# Altium project multimeter.prjpcb
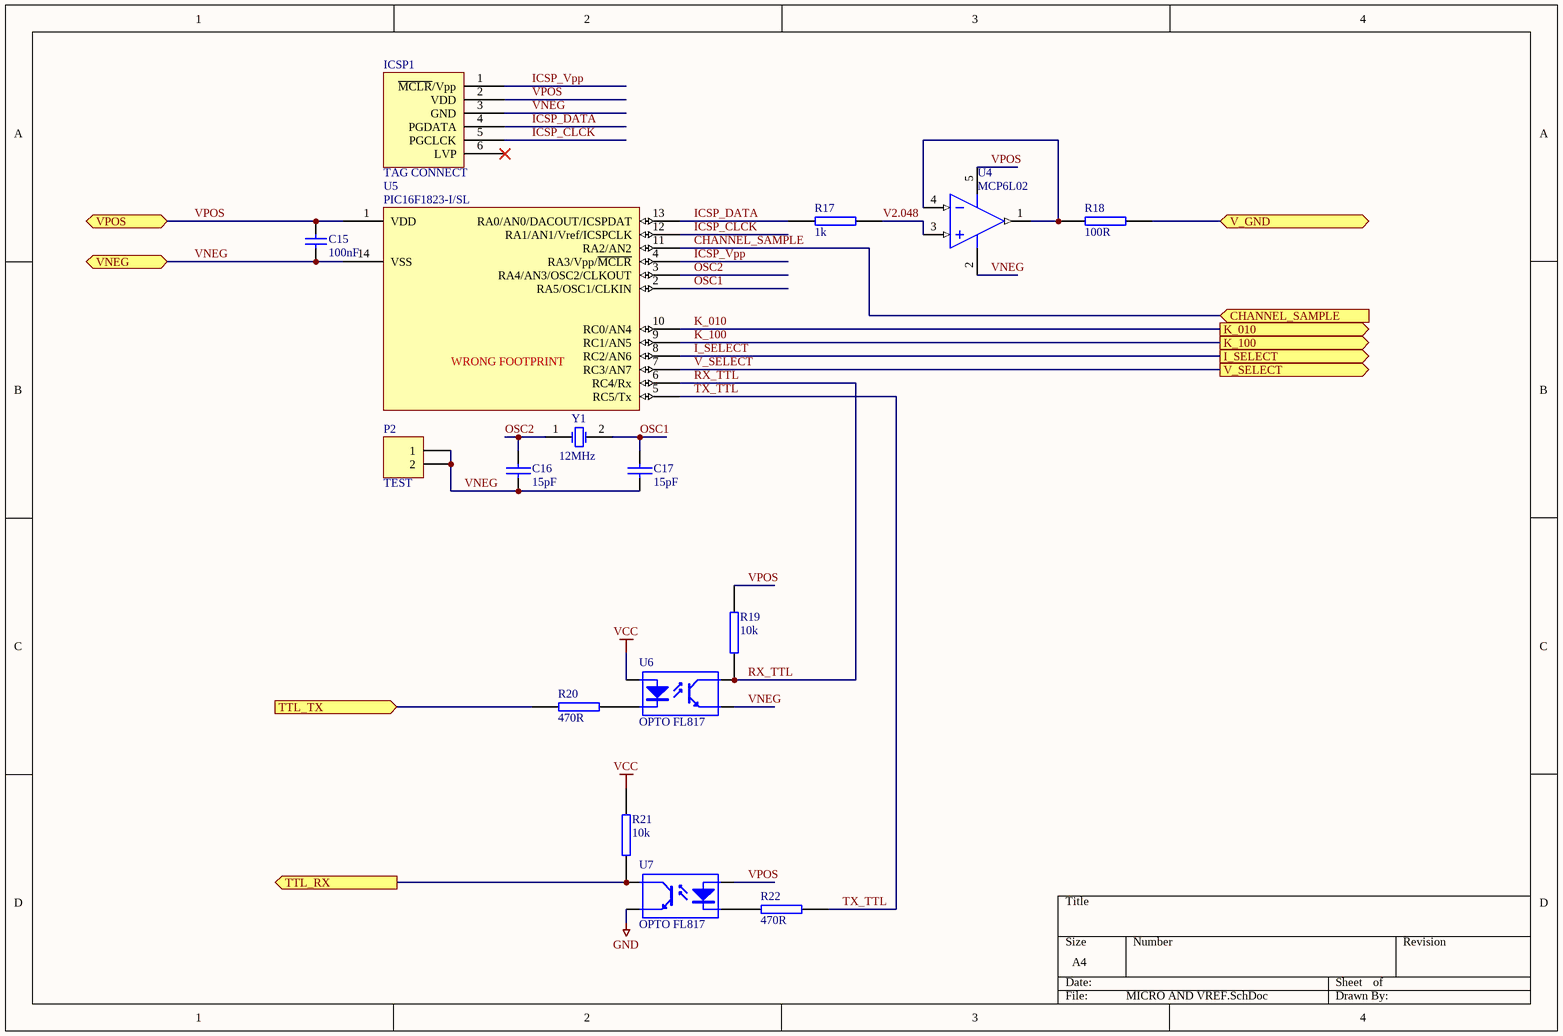
[diagram p0: MICRO AND VREF.SchDoc]
1 sheet, 16 parts. Net scope: flat (ports and power ports of the same name join across sheets).
Board files: m2m v00.PcbDoc, m2m V00 End Plate 00.PcbDoc, m2m V00 End Plate 01.PcbDoc, SEEED ORDER METER (BOOTSTRAP).PcbDoc

## Sheet MICRO AND VREF.SchDoc
size A4

### Parts
C15  100nF  [CAP (3D) - 0603]
C16  15pF  [CAP (3D) - 0603]
C17  15pF  [CAP (3D) - 0603]
ICSP1  TAG CONNECT  [ICSP - TAG CONNECT TYPE2]
P2  TEST  [HDR1X2]
R17  1k  [RES (3D) - 0603]
R18  100R  [RES (3D) - 0603]
R19  10k  [RES (3D) - 0603]
R20  470R  [RES (3D) - 0603]
R21  10k  [RES (3D) - 0603]
R22  470R  [RES (3D) - 0603]
U4  MCP6L02  [SOT23-5AL]
U5  PIC16F1823-I/SL  [SOIC-14]
U6  OPTO FL817  [DIP_4]
U7  OPTO FL817  [DIP_4]
Y1  value 12MHz  [CRYSTAL 3x8]  (hidden comment: XTAL)

### Ports
CHANNEL_SAMPLE (in), I_SELECT (out), K_010 (out), K_100 (out), TTL_RX, TTL_TX (in), V_GND (bidir), V_SELECT (out), VNEG (bidir), VPOS (bidir)

### Nets
GND: U7.3(E)
VCC: R21.1 U6.1(A)
CHANNEL_SAMPLE: U5.11(RA2/AN2) ; port CHANNEL_SAMPLE
I_SELECT: U5.8(RC2/AN6) ; port I_SELECT
ICSP_CLCK: ICSP1.5(PGCLCK) U5.12(RA1/AN1/Vref/ICSPCLK)
ICSP_DATA: ICSP1.4(PGDATA) R17.2 U5.13(RA0/AN0/DACOUT/ICSPDAT)
ICSP_Vpp: ICSP1.1(~{MCLR}/Vpp) U5.4(RA3/Vpp/~{MCLR})
K_010: U5.10(RC0/AN4) ; port K_010
K_100: U5.9(RC1/AN5) ; port K_100
OSC1: C17.1 U5.2(RA5/OSC1/CLKIN) Y1.2(OSC2)
OSC2: C16.1 U5.3(RA4/AN3/OSC2/CLKOUT) Y1.1(OSC1)
RX_TTL: R19.2 U5.6(RC4/Rx) U6.4(C)
TX_TTL: R22.2 U5.5(RC5/Tx)
V2.048: R17.1 U4.3(INA+)
V_SELECT: U5.7(RC3/AN7) ; port V_SELECT
VNEG: C15.1 C16.2 C17.2 ICSP1.3(GND) P2.1 P2.2 U4.2(GND) U5.14(VSS) U6.3(E) ; port VNEG
VPOS: C15.2 ICSP1.2(VDD) R19.1 U4.5(V+) U5.1(VDD) U7.1(A) ; port VPOS
NetR18_1: R18.1 U4.1(OUTA) U4.4(INA-)
NetR18_2: R18.2 ; port V_GND
NetR20_1: R20.1 ; port TTL_TX
NetR20_2: R20.2 U6.2(K)
NetR21_2: R21.2 U7.4(C) ; port TTL_RX
NetR22_1: R22.1 U7.2(K)

Not connected (* = marked no-connect by the designer): ICSP1 6(LVP)*

### Notes on the sheet
- (near U5) WRONG FOOTPRINT

### Library data of the parts
C15 = Cap: Capacitor; Value: 100nF; Supplier 1: Mouser; Supplier 2: Digi-Key; Supplier Part Number 1: 603-C0603ZRY5V9BB104; Supplier Part Number 2: 311-1343-2-ND
C16 C17 = CAP: CAPACITOR SMD 0402; Manufacturer: Xicon; Manufacturer Part No.: 140-CC504N150J-RC; value: 15pF; Mouser Part no.: 140-CC504N150J-RC; Web link: http://au.mouser.com/ProductDetail/Xicon/140-CC504N150J-RC/?qs=0ZUpllj3bsY%252bl3b%252btrhy8ZRrWnFRAos3
ICSP1 = ICSP - TAG CONNECT: Manufacturer: N/A - PCB ARTWORK; Manufacturer Part No.: N/A; Mouser Part no.: N/A; Web link: N/A - PCB ARTWORK
P2 = Header 2: Header, 2-Pin; Manufacturer: Bourns; Manufacturer Part No.: CR0603-FX-5900ELF; value: 590R; Mouser Part no.: 652-CR0603FX-5900ELF; Web link: http://au.mouser.com/Search/Refine.aspx?Keyword=652-CR0603FX-5900ELF
R17 R20 R22 = RES SMD 0603 1k: RESISTOR SMD 0603 1k
  R17: value: 1k
  R20 R22: value: 470R
R18 = RES SMD 0603: RESISTOR SMD 0603; value: 100R
R19 R21 = RES SMD 0603 100R: RESISTOR SMD 0603; Value: 10k
U4 = MCP6L01: Value: MCP6L02
U5 = PIC16F1823: Web Link: http://au.mouser.com/ProductDetail/Microchip-Technology/PIC16F1823-I-SL/?qs=sGAEpiMZZMvqv2n3s2xjsW2MXUmlRZqtARQgJEn43Ss%3d
U6 U7 = FL817: 4-Pin Phototransistor Optocoupler
Y1 = XTAL: Crystal Oscillator; Web link: http://au.mouser.com/ProductDetail/ECS/ECS-160-20-5PX-TR/?qs=CkbNAJEAr%2fRSmE52Hssuc4XnCMYWVt7B